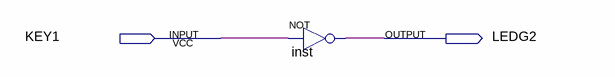
[diagram p0: schematic sheet]
// Quartus schematic main.bdf as structural Verilog: 1 symbols, 2 pins
module main (
  input  KEY1,
  output LEDG2
);

  not inst (LEDG2, KEY1);
endmodule
